# Altium schematic sheet 1_PWR-Switch.SchDoc
size A; SheetNumber: 2; SheetTotal: 11
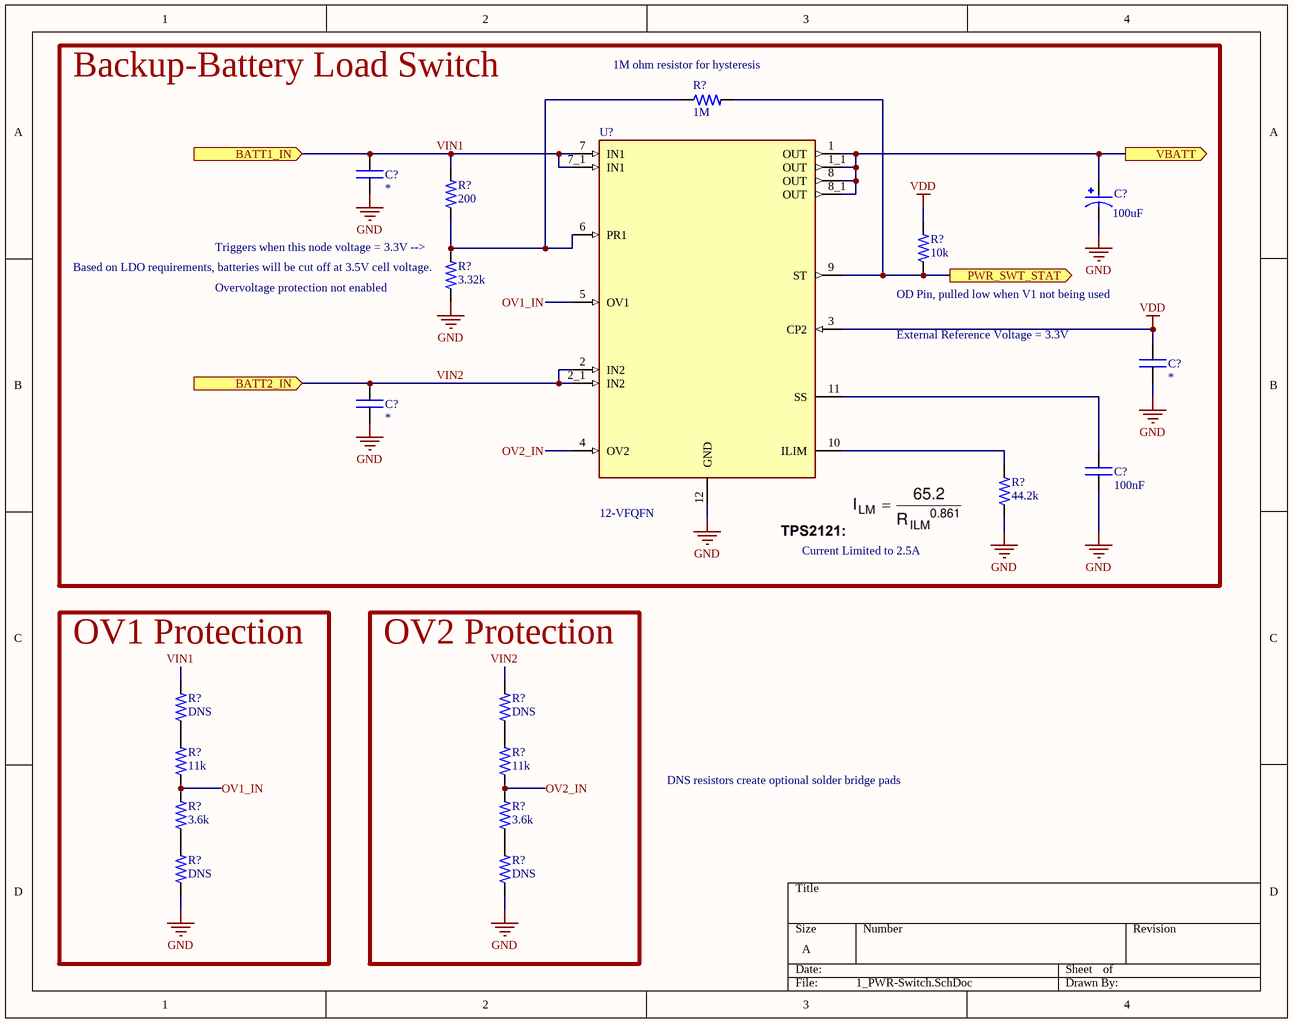
[diagram p0: 1_PWR-Switch.SchDoc]

## Parts
(Parts that share a designator on the sheet are numbered #1, #2 ... from top to bottom, then left to right.)
C?#1  CAP  [0402C]  (value not drawn)
C?#2  value 100uF  [CAP_POL_SMD]  (hidden comment: CAP POLARIZED)
C?#3  CAP  [0402C]  (value not drawn)
C?#4  CAP  [0402C]  (value not drawn)
C?#5  value 100nF  [0402C]  (hidden comment: CAP)
R?#1  value 1M  [0402R]  (hidden comment: RES)
R?#2  value 200  [0402R]  (hidden comment: RES)
R?#3  value 10k  [0402R]  (hidden comment: RES)
R?#4  value 3.32k  [0402R]  (hidden comment: RES)
R?#5  value 44.2k  [0402R]  (hidden comment: RES)
R?#6  value DNS  [0402R]  (hidden comment: RES)
R?#7  value DNS  [0402R]  (hidden comment: RES)
R?#8  value 11k  [0402R]  (hidden comment: RES)
R?#9  value 11k  [0402R]  (hidden comment: RES)
R?#10  value 3.6k  [0402R]  (hidden comment: RES)
R?#11  value 3.6k  [0402R]  (hidden comment: RES)
R?#12  value DNS  [0402R]  (hidden comment: RES)
R?#13  value DNS  [0402R]  (hidden comment: RES)
U?  12-VFQFN  [12-VFQFN]

## Blocks framed on the sheet
Backup-Battery Load Switch: C?#1-C?#5 R?#1-R?#5 U?
OV1 Protection: R?#6 R?#8 R?#10 R?#12
OV2 Protection: R?#7 R?#9 R?#11 R?#13

## Ports
BATT1_IN (in), BATT2_IN (in), PWR_SWT_STAT (out), VBATT (out)

## Nets
GND: C?#1.1 C?#2.2 C?#3.1 C?#4.1 C?#5.1 R?#4.1 R?#5.1 R?#12.1 R?#13.1 U?.12(GND)
VDD: C?#3.2 R?#3.2 U?.3(CP2)
OV1_IN: R?#8.1 R?#10.2 U?.5(OV1)
OV2_IN: R?#9.1 R?#11.2 U?.4(OV2)
PWR_SWT_STAT: R?#1.2 R?#3.1 U?.9(ST) ; port PWR_SWT_STAT
VBATT: C?#2.1 U?.1(OUT) U?.1_1(OUT) U?.8(OUT) U?.8_1(OUT) ; port VBATT
VIN1: C?#1.2 R?#2.2 R?#6.2 U?.7(IN1) U?.7_1(IN1) ; port BATT1_IN
VIN2: C?#4.2 R?#7.2 U?.2(IN2) U?.2_1(IN2) ; port BATT2_IN
NetC?#5_2: C?#5.2 U?.11(SS)
NetR?#1_1: R?#1.1 R?#2.1 R?#4.2 U?.6(PR1)
NetR?#5_2: R?#5.2 U?.10(ILIM)
NetR?#6_1: R?#6.1 R?#8.2
NetR?#7_1: R?#7.1 R?#9.2
NetR?#10_1: R?#10.1 R?#12.2
NetR?#11_1: R?#11.1 R?#13.2

## Notes on the sheet
- (near R?#1) 1M ohm resistor for hysteresis
- (near R?#4) Based on LDO requirements, batteries will be cut off at 3.5V cell voltage.
- (near R?#4) Triggers when this node voltage = 3.3V -->
- (near R?#4) Overvoltage protection not enabled
- (near R?#3) OD Pin, pulled low when V1 not being used
- External Reference Voltage = 3.3V
- Current Limited to 2.5A
- DNS resistors create optional solder bridge pads

## Library data of the parts
C?#1 C?#3 C?#4 = CAP: Capacitor; MFR: *; MFR PN: *; JLCPCB PN: *; Footprint: *; Value: *
C?#2 = CAP POLARIZED: MFR: PANASONIC; MFR PN: EEEHA1E101P; JLCPCB PN: C336392
C?#5 = CAP: Capaicitor; MFR: *; MFR PN: *
R?#1-R?#13 = RES: Resistor; MFR PN: *; MFR: *
  R?#1 R?#3 R?#6 R?#7 R?#12 R?#13: JLCPCB PN: *
  R?#2: JLCPCB PN: C784580
  R?#4: JLCPCB PN: C517700
  R?#5: JLCPCB PN: C25895
  R?#8 R?#9: JLCPCB PN: C319901
  R?#10 R?#11: JLCPCB PN: C423283
U? = TPS2121RUXR: 2.7-V to 22-V, 56-ma, 4.5-A, power mux with seamless switchover; MFR: Texas Instruments; Value: TPS2121RUXR; MFR PN: TPS2121RUXR